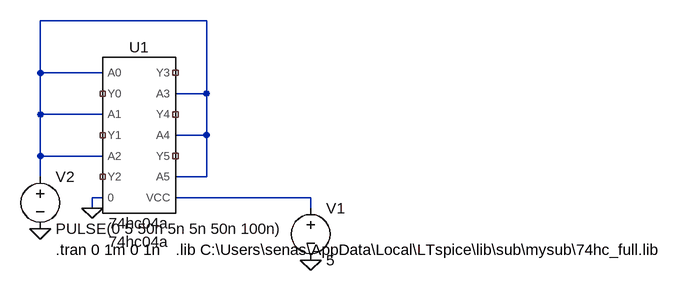
[diagram p0: schematic test04.asc]
test04.asc, the LTspice schematic file:
Version 4
SHEET 1 1336 680
WIRE 368 -96 112 -96
WIRE 112 -16 112 -96
WIRE 208 -16 112 -16
WIRE 368 16 368 -96
WIRE 368 16 320 16
WIRE 112 48 112 -16
WIRE 208 48 112 48
WIRE 368 80 368 16
WIRE 368 80 320 80
WIRE 112 112 112 48
WIRE 208 112 112 112
WIRE 112 144 112 112
WIRE 368 144 368 80
WIRE 368 144 320 144
WIRE 208 176 192 176
WIRE 528 176 320 176
WIRE 192 192 192 176
WIRE 528 192 528 176
FLAG 112 224 0
FLAG 192 192 0
FLAG 528 272 0
SYMBOL voltage 528 176 R0
SYMATTR InstName V1
SYMATTR Value 5
SYMBOL voltage 112 128 R0
WINDOW 123 0 0 Left 0
WINDOW 39 0 0 Left 0
SYMATTR InstName V2
SYMATTR Value PULSE(0 5 50n 5n 5n 50n 100n)
SYMBOL 74hc04a 256 80 R0
WINDOW 123 8 148 Top 2
SYMATTR InstName U1
SYMATTR SpiceModel 74hc04a
SYMATTR Value2 74hc04a
TEXT 136 256 Left 2 !.tran 0 1m 0 1n
TEXT 320 256 Left 2 !.lib C:\\Users\\senas\\AppData\\Local\\LTspice\\lib\\sub\\mysub\\74hc_full.lib

The netlist it stands for:
* test04.asc
V1 N002 0 5
V2 N001 0 PULSE(0 5 50n 5n 5n 50n 100n)
XU1 N001 NC_01 N001 NC_02 N001 NC_03 0 NC_04 N001 NC_05 N001 NC_06 N001 N002 74hc04a 74hc04a 74hc04a  ; pins A0 Y0 A1 Y1 A2 Y2 0 Y3 A3 Y4 A4 Y5 A5 VCC
.tran 0 1m 0 1n
.lib C:\Users\senas\AppData\Local\LTspice\lib\sub\mysub\74hc_full.lib
.lib C:\Users\senas\Documents\ŽÅ‰Y\DGK\CPU\HC4\HC4_KiCad\sim\74hc_full.lib
.backanno
.end